# EAGLE design Adafruit 2.7in Sharp Memory Display (EAGLE 9.6.2)
CHECKED: KTOWN; COMPANY: ADAFRUIT INDUSTRIES; DRAWN: KTOWN; REV: A
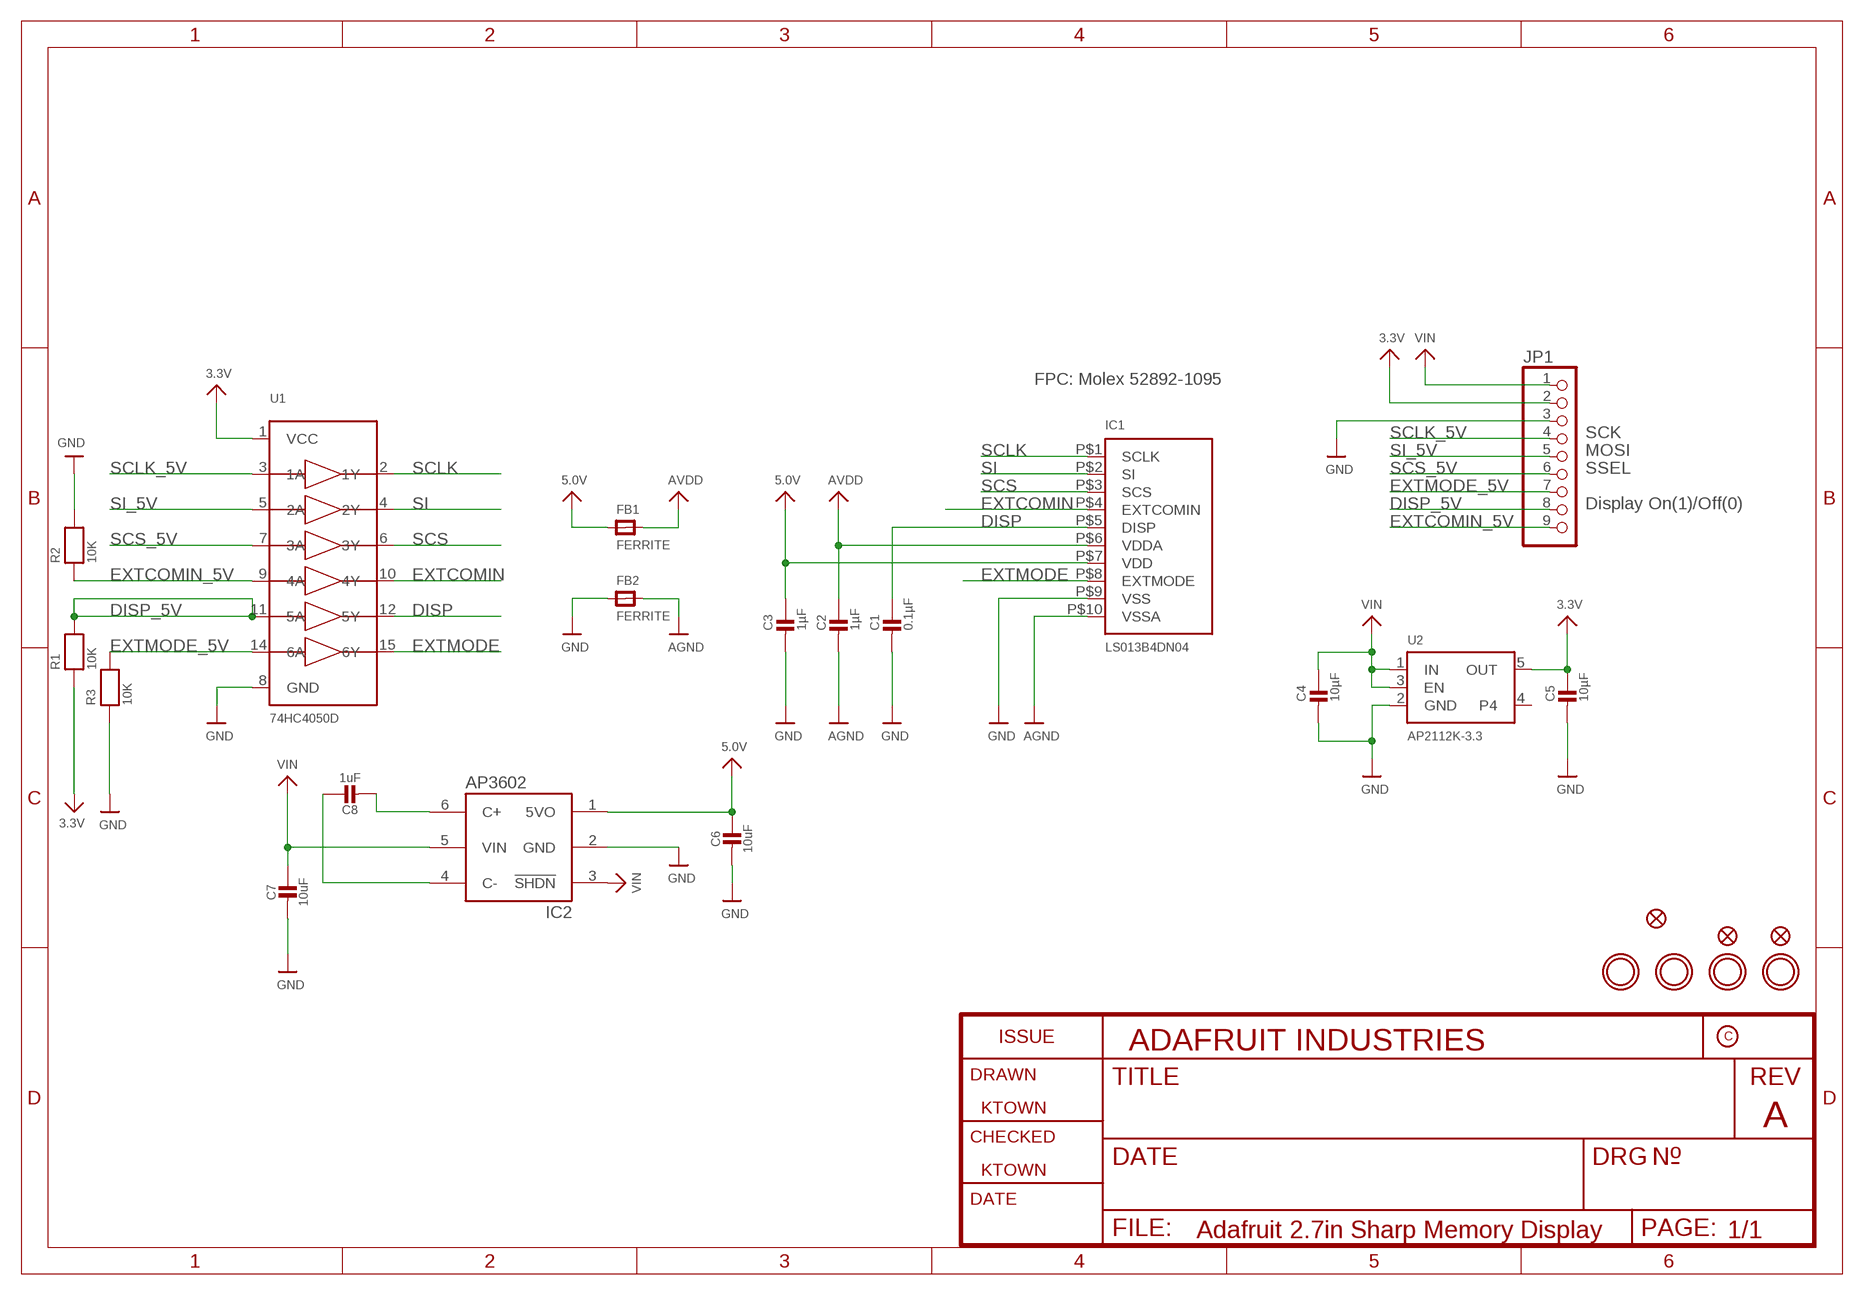
[diagram p0: schematic, sheet 1]

## Parts
C1  0.1µF  CAP_CERAMIC0603_NO  [0603-NO]
C2  1µF  CAP_CERAMIC0805_10MGAP  [0805_10MGAP]
C3  1µF  CAP_CERAMIC0805-NOOUTLINE  [0805-NO]
C4  10µF  CAP_CERAMIC0805-NOOUTLINE  [0805-NO]
C5  10µF  CAP_CERAMIC0805-NOOUTLINE  [0805-NO]
C6  10uF  CAP_CERAMIC0805-NOOUTLINE  [0805-NO]
C7  10uF  CAP_CERAMIC0805-NOOUTLINE  [0805-NO]
C8  1uF  CAP_CERAMIC0805-NOOUTLINE  [0805-NO]
FB1  FERRITE  FERRITE_0805  [_0805]
FB2  FERRITE  FERRITE_0805  [_0805]
FID1  FIDUCIAL_1MM  [FIDUCIAL_1MM]
FID2  FIDUCIAL_1MM  [FIDUCIAL_1MM]
FID3  FIDUCIAL_1MM  [FIDUCIAL_1MM]
IC1  LS013B4DN04  DISP_EINK_SHARPMEMORYLCD_10PIN_27IN  [SHARP_2.7IN]
IC2  AP3602  [SOT23-6]
JP1  HEADER-1X970MIL  [1X09_ROUND_70]
R1  10K  RESISTOR_0603_NOOUT  [0603-NO]
R2  10K  RESISTOR_0603_NOOUT  [0603-NO]
R3  10K  RESISTOR_0603_NOOUT  [0603-NO]
U1  74HC4050D  [SOIC16]
U2  AP2112K-3.3  VREG_SOT23-5  [SOT23-5]
U$21  MOUNTINGHOLE2.5_THICK  [MOUNTINGHOLE_2.5_PLATED_THICK]
U$22  MOUNTINGHOLE2.5_THICK  [MOUNTINGHOLE_2.5_PLATED_THICK]
U$27  MOUNTINGHOLE2.5  [MOUNTINGHOLE_2.5_PLATED]
U$28  MOUNTINGHOLE2.5  [MOUNTINGHOLE_2.5_PLATED]

## Nets
3.3V: C5.1 JP1.2 R1.1 U1.1(VCC) U2.5(OUT)
5.0V: C3.1 C6.1 FB1.1 IC1.P$7(VDD) IC2.1(5VO)
AGND: C2.2 FB2.2 IC1.P$10(VSSA)
AVDD: C2.1 FB1.2 IC1.P$6(VDDA)
DISP: C1.1 IC1.P$5(DISP) U1.12(5Y)
DISP_5V: JP1.8 R1.2 U1.11(5A)
EXTCOMIN: IC1.P$4(EXTCOMIN) U1.10(4Y)
EXTCOMIN_5V: JP1.9 R2.1 U1.9(4A)
EXTMODE: IC1.P$8(EXTMODE) U1.15(6Y)
EXTMODE_5V: JP1.7 R3.2 U1.14(6A)
GND: C1.2 C3.2 C4.2 C5.2 C6.2 C7.2 FB2.1 IC1.P$9(VSS) IC2.2(GND) JP1.3 R2.2 R3.1 U1.8(GND) U2.2(GND)
N$1: C8.2 IC2.6(C+)
N$2: C8.1 IC2.4(C-)
SCLK: IC1.P$1(SCLK) U1.2(1Y)
SCLK_5V: JP1.4 U1.3(1A)
SCS: IC1.P$3(SCS) U1.6(3Y)
SCS_5V: JP1.6 U1.7(3A)
SI: IC1.P$2(SI) U1.4(2Y)
SI_5V: JP1.5 U1.5(2A)
VIN: C4.1 C7.1 IC2.3(!SHDN) IC2.5(VIN) JP1.1 U2.1(IN) U2.3(EN)
Unconnected: U2.4

## Notes on the sheet
- FPC: Molex 52892-1095
- SCK
- MOSI
- SSEL
- Display On(1)/Off(0)

## Library data of the parts
C1-C3 C6-C8 = microbuilder:CAP_CERAMIC: Ceramic Capacitors For new designs, use the packages preceded by an '_' character since they are more reliable: The following footprints should be used on most boards: _0402 - Standard footprint for regular board layouts _0603 - Standard footprint for regular board layouts _0805 - Standard footprint for regular board layouts _1206 - Standard footprint for regular board layouts For extremely tight-pitch boards where space is at a premium, the following 'micro-pitch' footprints can be used (smaller pads, no silkscreen outline, etc.): _0402MP - Micro-pitch footprint for very dense/compact boards _0603MP - Micro-pitch footprint for very dense/compact boards _0805MP - Micro-pitch footprint for very dense/compact boards _1206MP - Micro-pitch footprint for very dense/compact boards
C4 C5 = microbuilder:CAP_CERAMIC: Ceramic Capacitors For new designs, use the packages preceded by an '_' character since they are more reliable: The following footprints should be used on most boards: _0402 - Standard footprint for regular board layouts _0603 - Standard footprint for regular board layouts _0805 - Standard footprint for regular board layouts _1206 - Standard footprint for regular board layouts For extremely tight-pitch boards where space is at a premium, the following 'micro-pitch' footprints can be used (smaller pads, no silkscreen outline, etc.): _0402MP - Micro-pitch footprint for very dense/compact boards _0603MP - Micro-pitch footprint for very dense/compact boards _0805MP - Micro-pitch footprint for very dense/compact boards _1206MP - Micro-pitch footprint for very dense/compact boards; REV: A
FB1 FB2 = microbuilder:FERRITE: Ferrite Bead 0603 MMZ1608B121C - 120 Ohm @ 100MHz, 600mA, 0.15 Ohm DC Resistance - Digikey: 445-2164-1-ND BK1608HW121-T - 120 Ohm, 600mA Ferrite Chip - Digikey: 587-1876-2-ND 0805 HZ0805B272R-10 - 2.7K Ohm @ 100MHz, 200mA, 0.8 Ohm DC Resistance - Digikey: 240-2504-1-ND (see also Murata BLM21BD272SN1L) MMZ2012Y152B - 1.5K Ohm @ 100MHz, 500mA, 0.4 Ohm DC Resistance - Digikey: 445-1560-1-ND - Mainly for high frequency (80-400MHz) MMZ2012R102A - 1K Ohm @ 100MHz, 500mA, 0.3 Ohm DC Resistance - Digikey: 445-1555-2-ND - More general purpose (10-200MHz)
FID1 FID2 = microbuilder:FIDUCIAL: Fiducial Alignment Points Various fiducial points for machine vision alignment.; BOM: EXCLUDE
FID3 = microbuilder:FIDUCIAL: Fiducial Alignment Points Various fiducial points for machine vision alignment.; BOM: EXCLUDE; REV: A
IC1 = adafruit_display:DISP_EINK_SHARPMEMORYLCD_10PIN: Sharp Mono Memory LCD LS013B4DN04 - 1.35" 96x96 Pixels LS027B7DH01 - 2.7" 400x240 Pixels FPC Connector: Molex 52892-1095 (WM9203CT-ND)
IC2 = microbuilder:AP3602
JP1 = microbuilder:HEADER-1X9: PIN HEADER
R1 R2 = microbuilder:RESISTOR: Resistors For new designs, use the packages preceded by an '_' character since they are more reliable: The following footprints should be used on most boards: _0402 - Standard footprint for regular board layouts _0603 - Standard footprint for regular board layouts _0805 - Standard footprint for regular board layouts _1206 - Standard footprint for regular board layouts For extremely tight-pitch boards where space is at a premium, the following 'micro-pitch' footprints can be used (smaller pads, no silkscreen outline, etc.): _0402MP - Micro-pitch footprint for very dense/compact boards _0603MP - Micro-pitch footprint for very dense/compact boards _0805MP - Micro-pitch footprint for very dense/compact boards _1206MP - Micro-pitch footprint for very dense/compact boards
R3 = microbuilder:RESISTOR: Resistors For new designs, use the packages preceded by an '_' character since they are more reliable: The following footprints should be used on most boards: _0402 - Standard footprint for regular board layouts _0603 - Standard footprint for regular board layouts _0805 - Standard footprint for regular board layouts _1206 - Standard footprint for regular board layouts For extremely tight-pitch boards where space is at a premium, the following 'micro-pitch' footprints can be used (smaller pads, no silkscreen outline, etc.): _0402MP - Micro-pitch footprint for very dense/compact boards _0603MP - Micro-pitch footprint for very dense/compact boards _0805MP - Micro-pitch footprint for very dense/compact boards _1206MP - Micro-pitch footprint for very dense/compact boards; REV: A
U1 = microbuilder:74HC4050D: 6-channel level shifter 74HC4050D - 2V-6V Supply SOIC16 Digikey: 74HC4050D,653-ND Mouser: 771-74HC4050D-T TSSOP16 Digikey: 296-9215-1-ND Mouser:
U2 = adafruit_power:VREG_SOT23-5: SOT23-5 Fixed Voltage Regulators Part Current Out V Out V In V Dropout θJA (°C/W) TJ (°C) Digikey Part No. ADP121 150mA 3.3V 3.4-5.5V 0.09V @ 150mA -- -- ADP121-AUJZ33R7CT-ND ADP121 150mA 3.0V 3.1-5.5V 0.09V @ 150mA -- -- ADP121-AUJZ30R7CT-ND ADP122 300mA 3.3V 3.4-5.5V 0.085V @ 300mA -- -- ADP122AUJZ-3.3-R7CT-ND ADP1712 300mA 3.3V 3.5-5.5V 0.17V @ 300mA -- -- ADP1712AUJZ-3.3-R7TR-ND AP7311 (Low Cost) 150mA 3.3V 3.5-6V 0.15V @ 150mA -- -- AP7311-33WG-7DICT-ND LD39015M18R 150mA 1.8V 1.9V-5.5V 0.08V @ 100mA -- -- 497-6977-1-ND LP2985A-33DBVR 150mA 3.3V 3.3-16V 0.28V @ 150mA 206 150 296-18479-1-ND MCP1824T-3302E/OT 300mA 3.3V 3.5V-6V 0.2V @ 300mA -- -- MCP1824T-3302E/OTCT-ND MIC5205-2.5YM5 TR 150mA 2.5V 2.7-16V 0.165V @ 150mA -- -- 576-1257-2-ND MIC5205-3.0YM5 TR 150mA 3.0V 3.2V-16V 0.165V @ 150mA -- -- 576-1258-2-ND MIC5205-3.3YM5 TR 150mA 3.3V 3.5V-16V 0.165V @ 150mA -- -- 576-1259-2-ND TPS780330220 150mA 3.3V+2.2V 3.6-5.5V 250mV Max -- -- 296-23332-1-ND TDA3663/N1,135 100mA 3.3V 3.5-45V 0.18V @ 50mA -- -- 568-5343-1-ND Max operating temp can be calculated using θJA, TJ (max junction temperature), and power in watts. Set the "Maximum Ambient Temperature" until it reaches TJ ("Max Junction Temperature"), which is the absolute limit for safe use of the regulator: Heat Sink Temperature Calculator <http://www.daycounter.com/Calculators/Heat-Sink-Temperature-Calculator.phtml> For example, With 12V source into a 3.3V LP2985 and a 30mA load, we are dissipating (12V-3.3V) * 0.03A = 0.261W. With a θJA of 206 °C/W, a TJ of 150°C, and 261mW we can safely use the chip without a heat sink up to 75°C (=147.1°C Junction Temperature).
U$21 U$22 = microbuilder:MOUNTINGHOLE: Mounting Hole For #2 screws (0.086"/2.18mm width, 0.094"/2.4mm hole) use 2.5mm; BOM: EXCLUDE
U$27 U$28 = microbuilder:MOUNTINGHOLE: Mounting Hole For #2 screws (0.086"/2.18mm width, 0.094"/2.4mm hole) use 2.5mm; BOM: EXCLUDE; REV: A

## Board
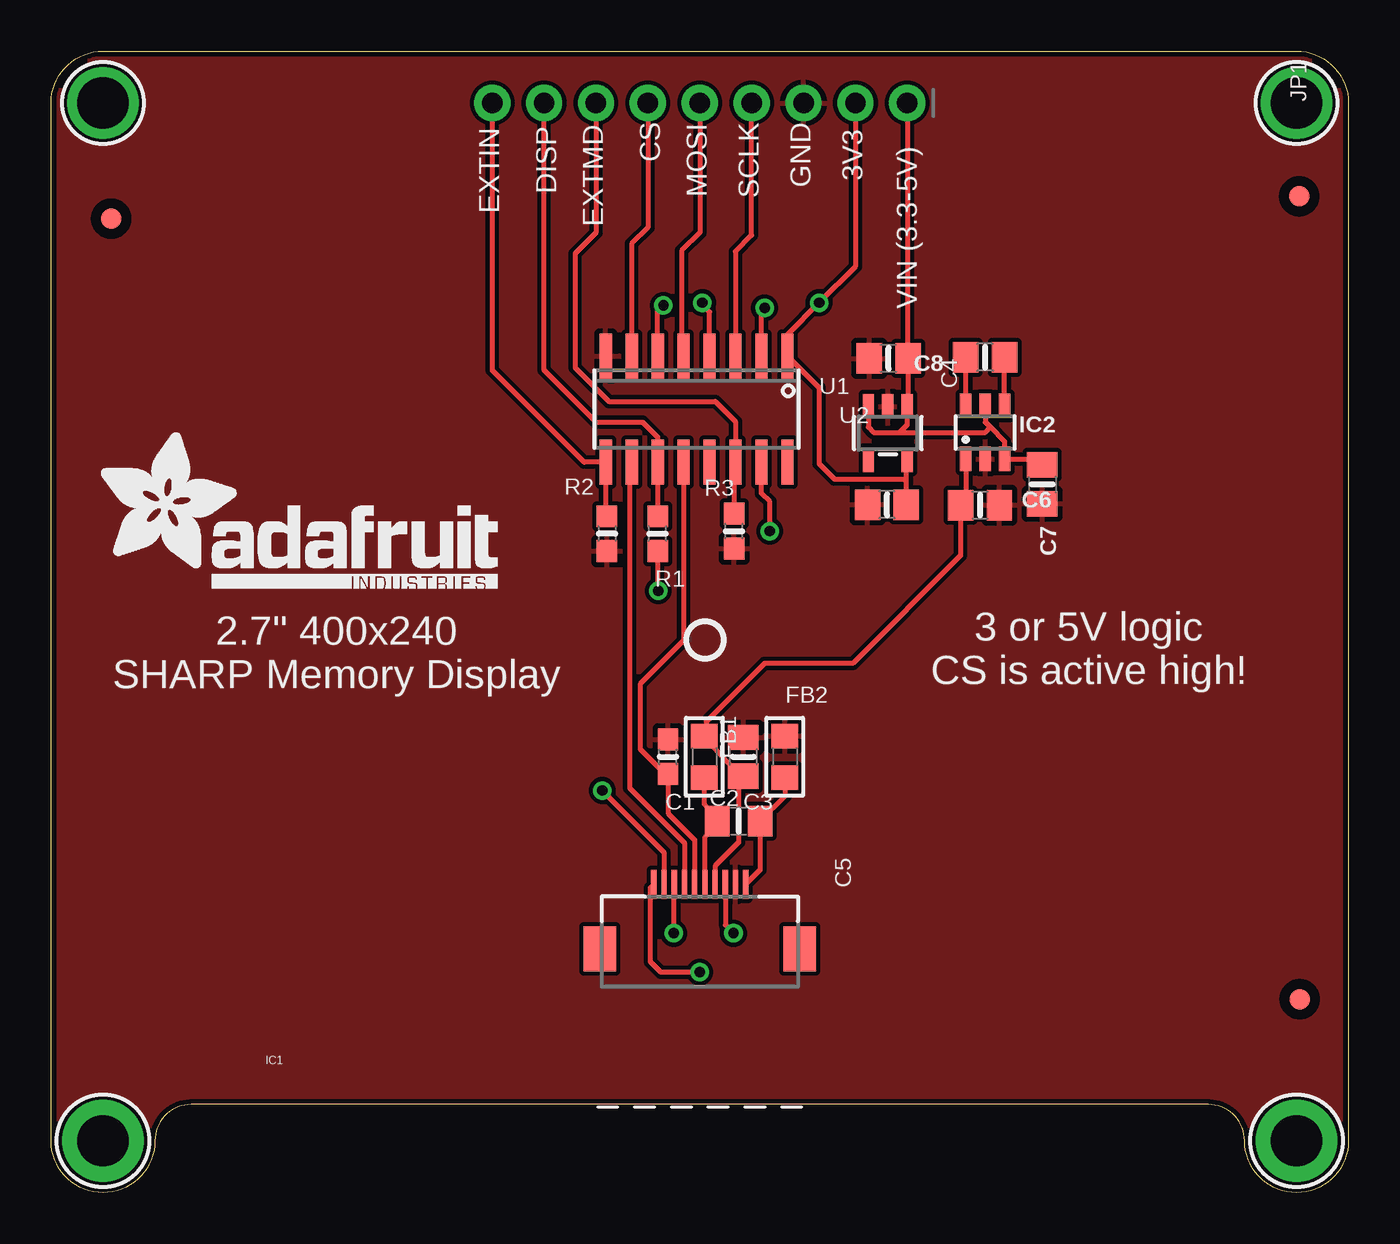
[diagram p1: board, top side]
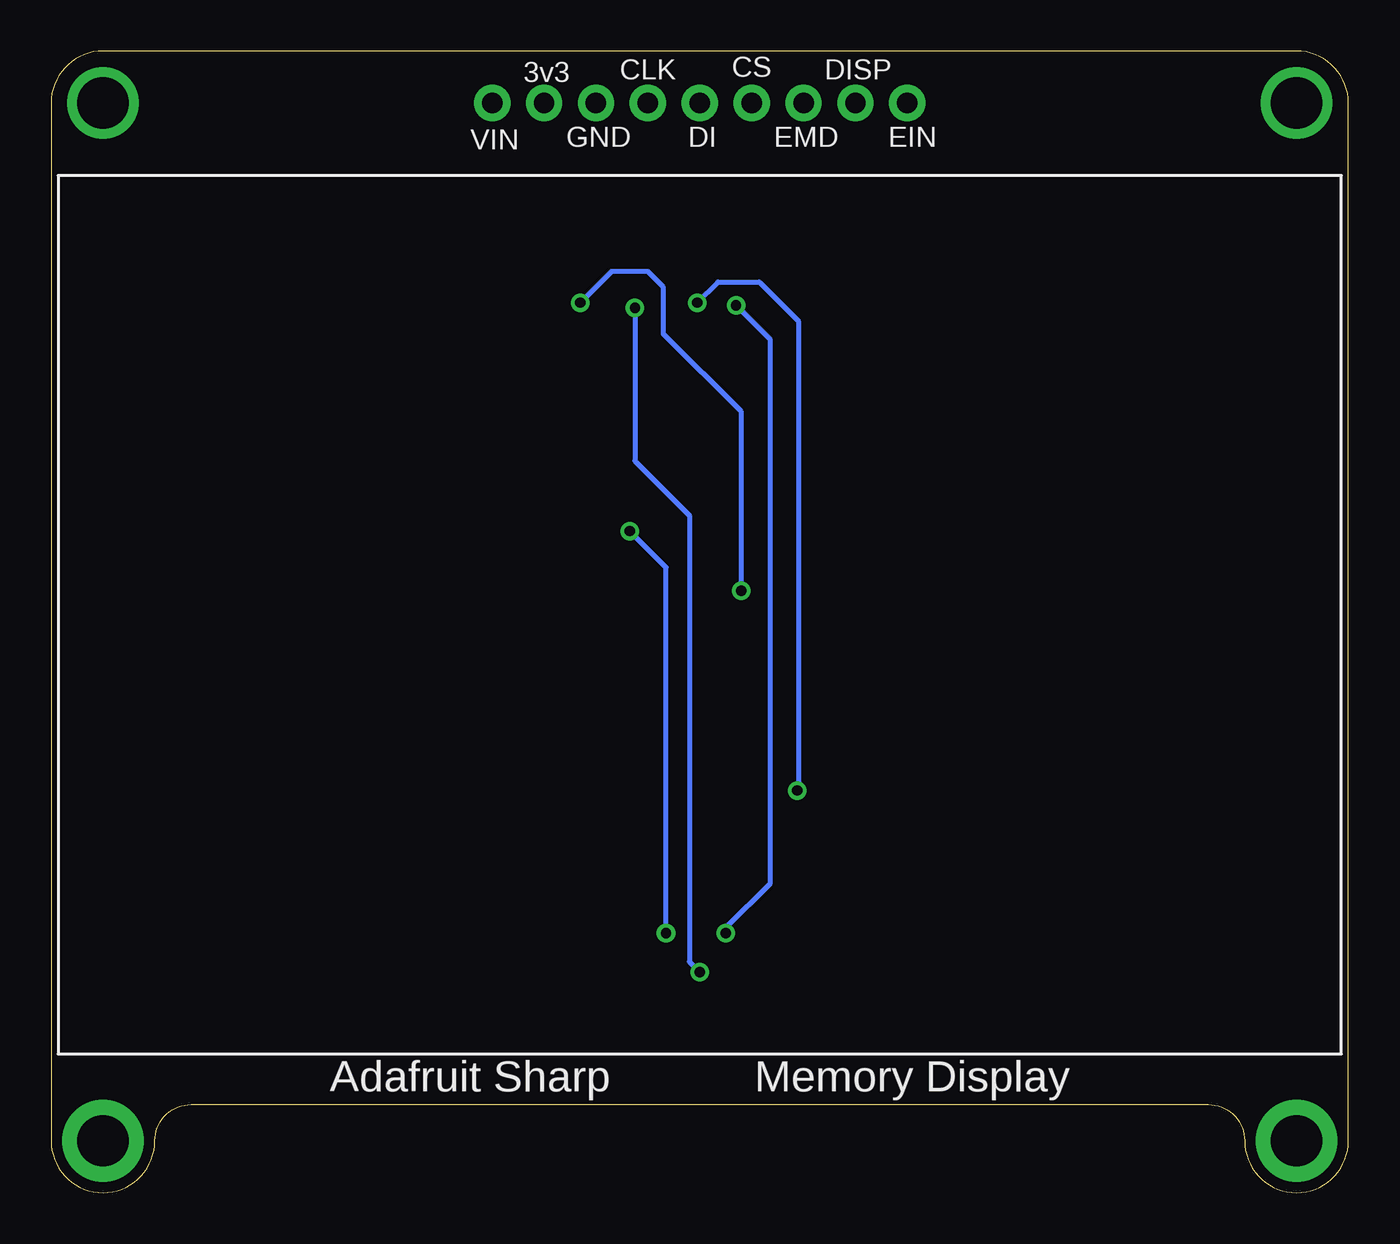
[diagram p2: board, bottom side, seen from below]

Size 63.5 x 55.88 mm. Coordinates in mm from the lower left corner, seen from the top.
Outline: 2.54,55.88 60.96,55.88 arc-90 63.5,53.34 63.5,2.54 arc-90 60.96,0 arc-90 58.42,2.54 arc90 56.64,4.32 6.86,4.32 arc90 5.08,2.54 arc-90 2.54,0 arc-90 0,2.54 0,53.34 arc-90 2.54,55.88
Copper layers (1*16): Top 0.035mm / dielectric 1.5mm / Bottom 0.035mm
Design rules "adafruit 7-7": minimum track width 6mil, minimum drill 15.5mil, track to track 8mil, track to pad 7mil, pad to pad 7mil, via to via 7mil, smd to smd 7mil, copper to edge 10mil, drill to drill 8mil, minimum pad ring 10mil, minimum via ring 8mil, stop-mask expansion 2mil, vias tented up to drill 20mil, thermal gap 10mil

### Footprints (pad centres in the part's own frame; a part is rotated, then mirrored left to right if it is on the bottom)
0603-NO = smd 1.075 x 1: 1 -0.85,0; 2 0.85,0
0805_10MGAP = smd 1.2 x 1.5: 1 -1.05,0; 2 1.05,0
0805-NO = smd 1.24 x 1.5: 1 -0.95,0; 2 0.95,0
_0805 = smd 1.2 x 1.3: 1 -1.016,0; 2 1.016,0
FIDUCIAL_1MM = smd 1 x 1: 1 0,0
SHARP_2.7IN = smd 0.25 x 1.4: P$1 -2.25,2.9; P$2 -1.75,2.9; P$3 -1.25,2.9; P$4 -0.75,2.9; P$5 -0.25,2.9; P$6 0.25,2.9; P$7 0.75,2.9; P$8 1.25,2.9; P$9 1.75,2.9; P$10 2.25,2.9 | smd 1.6 x 2.2: SUPPORT1 -4.9,-0.25; SUPPORT2 4.9,-0.25
SOT23-6 = smd 0.55 x 1.2: 1 -0.95,-1.3; 2 0,-1.3; 3 0.95,-1.3; 4 0.95,1.3; 5 0,1.3; 6 -0.95,1.3
1X09_ROUND_70 = drill 1 pad 1.778: 1 -10.16,0; 2 -7.62,0; 3 -5.08,0; 4 -2.54,0; 5 0,0; 6 2.54,0; 7 5.08,0; 8 7.62,0; 9 10.16,0
SOIC16 = smd 0.6 x 2.2: 1 -4.445,-2.6; 2 -3.175,-2.6; 3 -1.905,-2.6; 4 -0.635,-2.6; 5 0.635,-2.6; 6 1.905,-2.6; 7 3.175,-2.6; 8 4.445,-2.6; 9 4.445,2.6; 10 3.175,2.6; 11 1.905,2.6; 12 0.635,2.6; 13 -0.635,2.6; 14 -1.905,2.6; 15 -3.175,2.6; 16 -4.445,2.6
SOT23-5 = smd 0.55 x 1.2: 1 -0.95,-1.3; 2 0,-1.3; 3 0.95,-1.3; 4 0.95,1.3; 5 -0.95,1.3
MOUNTINGHOLE_2.5_PLATED_THICK = drill 2.5 pad 4: P$1 0,0
MOUNTINGHOLE_2.5_PLATED = drill 2.5 pad 3.2: P$1 0,0

### Placement (x,y rotation side)
C1  30.2,21.34 90 top
C2  33.66,18.19 0 top
C3  33.88,21.34 90 top
C4  40.99,40.83 180 top
C5  40.91,33.67 180 top
C6  45.47,33.66 0 top
C7  48.51,34.67 270 top
C8  45.72,40.89 180 top
FB1  31.97,21.34 270 top
FB2  35.91,21.34 270 top
FID1  2.94,47.68 180 top
FID2  61.12,9.47 180 top
FID3  61.09,48.77 180 top
IC1  31.75,12.19 0 top
IC2  45.72,37.21 0 top
JP1  31.75,53.34 180 top
R1  29.69,32.26 90 top
R2  27.21,32.26 270 top
R3  33.43,32.38 90 top
U1  31.59,38.35 180 top
U2  40.95,37.18 180 top
U$21  60.96,2.54 90 top
U$22  2.54,2.54 270 top
U$27  60.96,53.34 270 top
U$28  2.54,53.34 90 top
U$29  [PCBFEAT-REV-040]  32,27.05 0 top
U$32  [ADAFRUIT_TEXT_20MM]  2.29,29.59 0 top

### Tracks (layer width: path | path; a pad name or v marks a point on that pad's centre or on a via)
3.3V  (via drill 0.5)
  Top 0.254: JP1.2 39.37,45.34 v37.59,43.56 36.04,42.01 U1.1 37.59,39.4 37.59,35.69 38.35,34.92 41.73,34.92 41.86,34.8 | C5.1 41.86,34.8 | 41.86,34.8 41.86,35.84 U2.5 | R1.1 29.69,29.49 v29.72,29.46
  Bottom 0.254: v29.72,29.46 29.72,38.23 33.53,42.04 33.53,44.32 34.29,45.09 36.07,45.09 v37.59,43.56
5.0V
  Top 0.254: IC2.1 44.77,33.91 C6.1 44.52,31.18 39.24,25.91 34.92,25.91 32.07,23.06 32.07,22.61 31.97,22.51 FB1.1 32.07,22.25 32.07,22.17 33.75,20.39 C3.1 33.66,20.39 33.66,17.14 32.5,15.99 IC1.P$7
AGND
  Top 0.254: FB2.2 35.91,19.4 C2.2 34.7,15.8 IC1.P$10
AVDD
  Top 0.254: IC1.P$6 32,17.39 C2.1 31.97,19.02 FB1.2
DISP
  Top 0.254: U1.12 30.96,27.02 28.83,24.89 28.83,21.72 30.06,20.49 C1.1 30.2,18.57 31.5,17.27 IC1.P$5
DISP_5V
  Top 0.254: R1.2 U1.11 29.69,36.99 28.96,37.72 26.67,37.72 24.13,40.26 JP1.8
EXTCOMIN
  Top 0.254: U1.10 28.32,35.66 28.32,19.8 31,17.12 IC1.P$4
EXTCOMIN_5V
  Top 0.254: R2.1 27.15,33.17 U1.9 26.09,35.75 21.59,40.26 JP1.9
EXTMODE  (via drill 0.5)
  Top 0.254: IC1.P$8 33,13.1 v33.4,12.7 | v35.18,32.39 35.18,33.82 34.77,34.23 U1.15
  Bottom 0.254: v33.4,12.7 33.4,30.61 v35.18,32.39
EXTMODE_5V
  Top 0.254: JP1.7 26.67,46.99 25.65,45.97 25.65,40.39 27.3,38.73 32.51,38.73 33.5,37.75 U1.14 33.43,35.68 R3.2
GND
  pour Top: 0,55.88 63.5,55.88 63.5,0 0,0
N$1
  Top 0.254: IC2.6 C8.2
N$2
  Top 0.254: IC2.4 C8.1
SCLK  (via drill 0.5)
  Top 0.254: U1.2 34.77,43.15 v34.92,43.31 | v31.75,10.79 29.84,10.79 29.34,11.3 29.34,14.93 IC1.P$1
  Bottom 0.254: v34.92,43.31 34.92,35.81 32.26,33.15 32.26,11.3 v31.75,10.79
SCLK_5V
  Top 0.254: U1.3 33.5,46.07 34.29,46.86 JP1.4
SCS  (via drill 0.5)
  Top 0.254: U1.6 29.69,43.15 v29.97,43.43 | v30.48,12.7 30.48,15.07 IC1.P$3
  Bottom 0.254: v29.97,43.43 28.32,41.78 28.32,15.11 30.48,12.95 v30.48,12.7
SCS_5V
  Top 0.254: JP1.6 29.21,47.24 28.42,46.45 U1.7
SI  (via drill 0.5)
  Top 0.254: U1.4 32.23,43.11 31.88,43.47 v31.88,43.56 | v26.98,19.69 30,16.66 IC1.P$2
  Bottom 0.254: v31.88,43.56 30.86,44.58 28.83,44.58 26.92,42.67 26.92,19.74 v26.98,19.69
SI_5V
  Top 0.254: JP1.5 31.75,46.99 30.86,46.1 30.86,41.05 U1.5
VIN
  Top 0.254: JP1.1 41.91,40.87 C4.1 41.94,38.52 U2.1 41.9,37.59 41.53,37.21 | U2.3 40,37.47 40.26,37.21 41.53,37.21 | IC2.5 45.72,37.72 45.97,37.47 | 45.97,37.47 46.67,36.77 IC2.3 48.22,35.91 C7.1 | 41.53,37.21 45.72,37.21 45.97,37.47

### Text on the board
tPlace: CS | DISP | MOSI | SCLK | GND | 3V3 | EXTIN | EXTMD | VIN (3.3-5V) | 3 or 5V logic / CS is active high! | 2.7" 400x240 / SHARP Memory Display
bPlace: DISP | CS | CLK | 3v3 | EIN | EMD | DI | GND | VIN | Adafruit Sharp Memory Display